# Altium schematic sheet BlockDiagram.SchDoc
size A4; DrawnBy: Santiago Rodriguez; Revision: V1; SheetNumber: 1; SheetTotal: 9
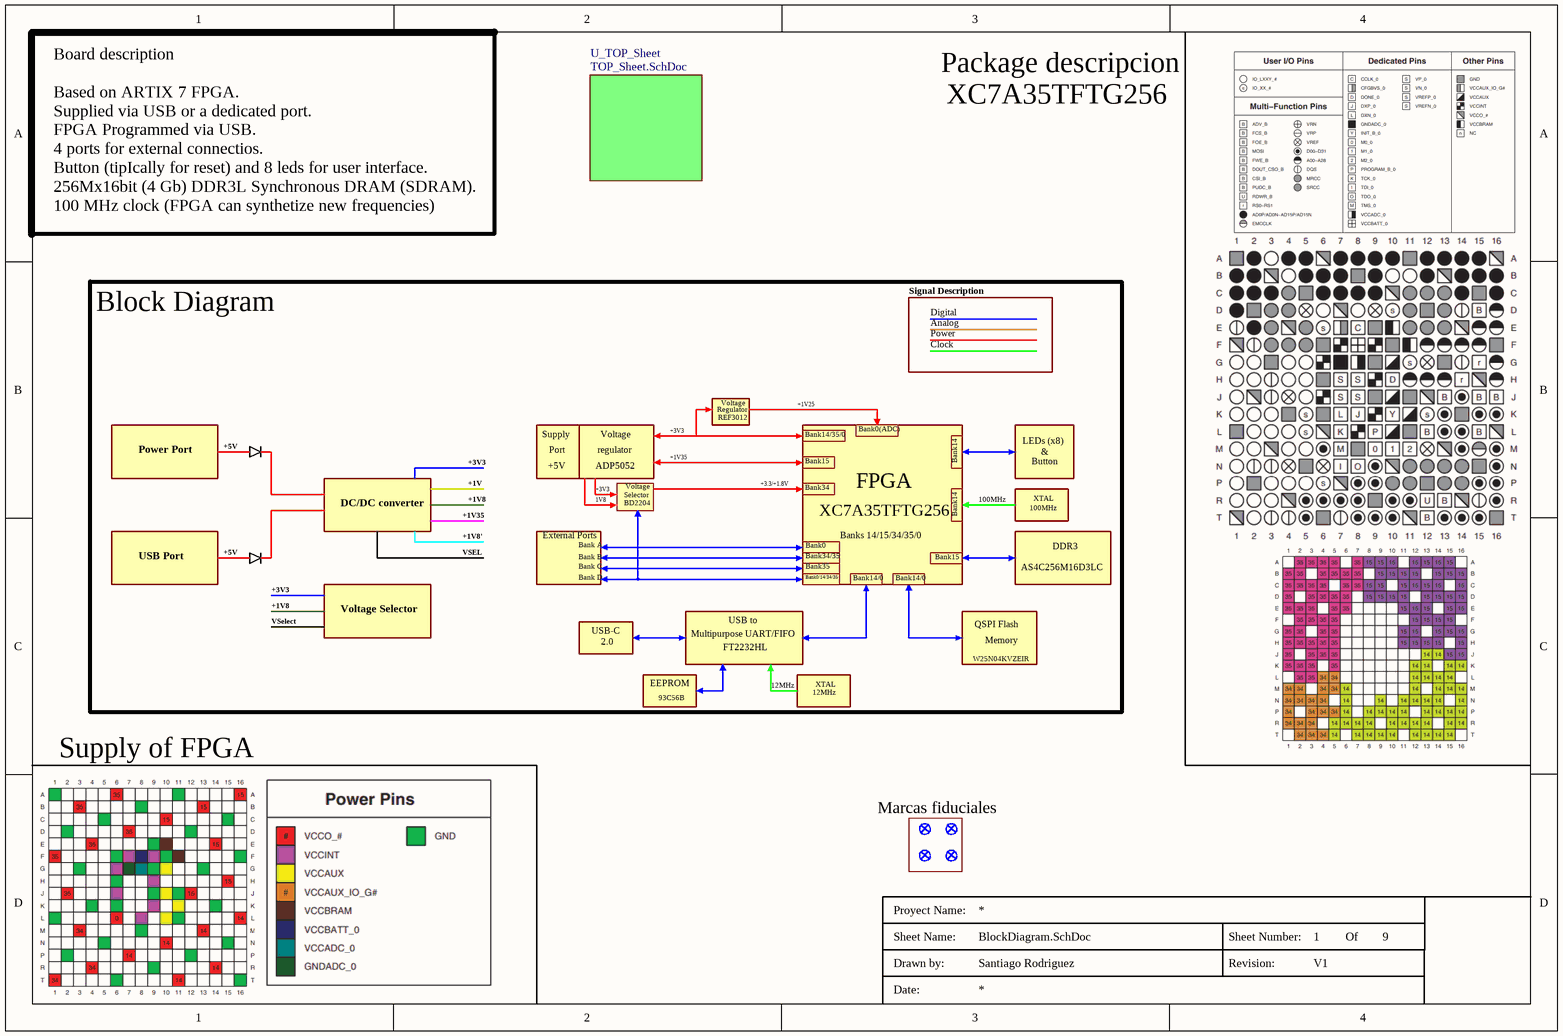
[diagram p0: BlockDiagram.SchDoc]

## Sub-sheets
U_TOP_Sheet = TOP_Sheet.SchDoc: no entries

## Notes on the sheet
- Package descripcion
- XC7A35TFTG256
- Board description
  Based on ARTIX 7 FPGA.
  Supplied via USB or a dedicated port.
  FPGA Programmed via USB.
  4 ports for external connectios.
  Button (tipIcally for reset) and 8 leds for user interface.
  256Mx16bit (4 Gb) DDR3L Synchronous DRAM (SDRAM).
  100 MHz clock (FPGA can synthetize new frequencies)
- Block Diagram
- Signal Description
- Digital
- Power
- Analog
- Clock
- Power Port
- +5V
- Supply
- Port
- regulator
- Voltage
- +3V3
- Regulator
- REF3012
- +1V25
- Bank14/35/0
- Bank0(ADC)
- LEDs (x8)
- DC/DC converter
- +1V35
- +1V
- +1V8
- ADP5052
- 1V8
- Selector
- BD2204
- +3.3/+1.8V
- Bank15
- Bank34
- FPGA
- Bank14
- 100MHz
- Button
- XTAL
- &
- USB Port
- +1V8'
- VSEL
- External Ports
- Bank A
- Bank B
- Bank C
- Bank D
- Bank0
- Bank34/35
- Bank35
- Bank0/14/34/35
- Banks 14/15/34/35/0
- Bank14/0
- AS4C256M16D3LC
- DDR3
- VSelect
- Voltage Selector
- USB-C
- 2.0
- Multipurpose UART/FIFO
- FT2232HL
- USB to
- QSPI Flash
- Memory
- EEPROM
- 93C56B
- 12MHz
- W25N04KVZEIR
- Supply of FPGA
- Marcas fiduciales
- Proyect Name:
- Sheet Name:
- Drawn by:
- Revision:
- Sheet Number:
- Of
- Date: